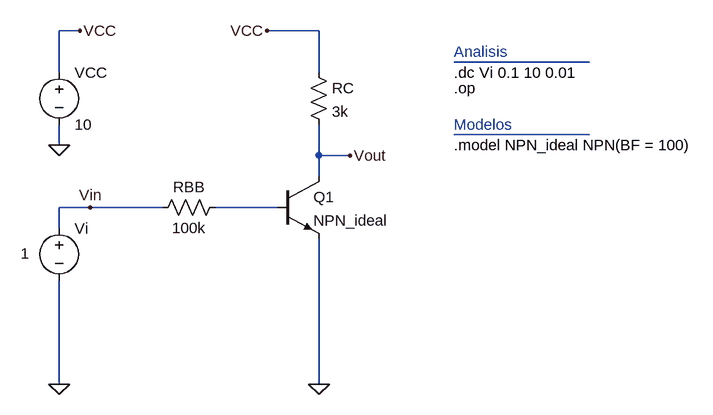
[diagram p0: schematic bjt_amp-ejemplo1-dc_sweep.asc]
bjt_amp-ejemplo1-dc_sweep.asc, the LTspice schematic file:
Version 4
SHEET 1 880 680
WIRE -288 -176 -320 -176
WIRE 80 -176 0 -176
WIRE 496 -128 288 -128
WIRE -320 -112 -320 -176
WIRE 80 -112 80 -176
WIRE 496 -16 288 -16
WIRE -320 0 -320 -32
WIRE 80 16 80 -32
WIRE 128 16 80 16
WIRE 80 48 80 16
WIRE -272 96 -320 96
WIRE -160 96 -272 96
WIRE 16 96 -80 96
WIRE -320 128 -320 96
WIRE -320 368 -320 208
WIRE 80 368 80 144
FLAG 80 368 0
FLAG -320 0 0
FLAG -288 -176 VCC
FLAG -320 368 0
FLAG 0 -176 VCC
FLAG 128 16 Vout
FLAG -272 96 Vin
SYMBOL npn 16 48 R0
SYMATTR InstName Q1
SYMATTR Value NPN_ideal
SYMBOL res -64 80 R90
WINDOW 0 0 56 VBottom 2
WINDOW 3 32 56 VTop 2
SYMATTR InstName RBB
SYMATTR Value 100k
SYMBOL res 64 -128 R0
SYMATTR InstName RC
SYMATTR Value 3k
SYMBOL voltage -320 -128 R0
WINDOW 123 0 0 Left 0
WINDOW 39 0 0 Left 0
SYMATTR InstName VCC
SYMATTR Value 10
SYMBOL voltage -320 112 R0
WINDOW 3 -59 55 Left 2
WINDOW 123 0 0 Left 0
WINDOW 39 0 0 Left 0
SYMATTR Value 1
SYMATTR InstName Vi
TEXT 288 -112 Left 2 !.dc Vi 0.1 10 0.01
TEXT 288 -144 Left 2 ;Analisis
TEXT 288 -88 Left 2 !.op
TEXT 288 0 Left 2 !.model NPN_ideal NPN(BF = 100)
TEXT 288 -32 Left 2 ;Modelos

The netlist it stands for:
* bjt_amp-ejemplo1-dc_sweep.asc
Q1 Vout N003 0 0 NPN_ideal
RBB N003 Vin 100k
RC VCC Vout 3k
VCC VCC 0 10
Vi Vin 0 1
.model NPN NPN
.model PNP PNP
.lib standard.bjt
.dc Vi 0.1 10 0.01
* Analisis
.op
.model NPN_ideal NPN(BF = 100)
* Modelos
.backanno
.end